# EAGLE design warm_floor (EAGLE 7.4.0)
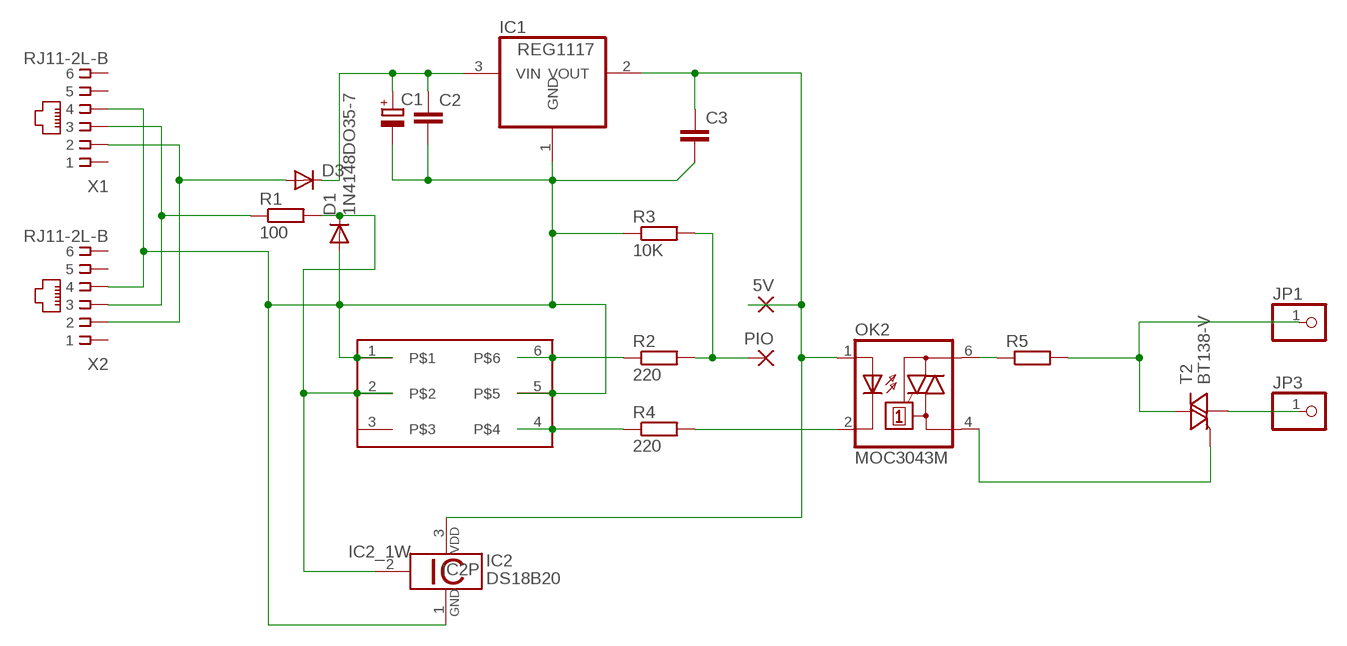
[diagram p0: schematic, sheet 1]

## Parts
5V  1,6/0,8  [1,6/0,8]
C1  CPOL-EUE5-10.5  [E5-10,5]
C2  C-EUC1206  [C1206]
C3  C-EUC1206  [C1206]
D1  1N4148DO35-7  [DO35-7]
D3  DIODE-MINIMELF  [MINIMELF]
DS2413  DS2413P  [TSOC6]
IC1  REG1117  [SOT223]
IC2  DS18B20  [TO92-]
JP1  PINHD-1X1  [1X01]
JP3  PINHD-1X1  [1X01]
OK2  MOC3043M  [DIL06]
PIO  1,6/0,8  [1,6/0,8]
R1  100  R-EU_M1206  [M1206]
R2  220  R-EU_M1206  [M1206]
R3  10K  R-EU_M1206  [M1206]
R4  220  R-EU_M1206  [M1206]
R5  R-EU_M1206  [M1206]
T2  BT138-V  [TO220BV]
X1  RJ11-2L-B  [RJ11-NO_SHIELD]
X2  RJ11-2L-B  [RJ11-NO_SHIELD]

## Nets
N$1: PIO.1(P) R2.2 R3.2
N$2: R1.1 X1.3 X2.3
N$3: D3.A X1.2 X2.2
N$4: D1.C DS2413.2 IC2.2 R1.2
N$5: C1.+ C2.1 D3.C IC1.3(VIN)
N$6: 5V.1(P) C3.1 IC1.2(VOUT) IC2.3 OK2.1(A)
N$8: OK2.4(A1) T2.G
N$9: DS2413.6 R2.1
N$10: DS2413.4 R4.1
N$11: C1.- C2.2 C3.2 D1.A DS2413.1 DS2413.5 IC1.1(GND) IC2.1 R3.1 X1.4 X2.4
N$12: OK2.2(C) R4.2
N$14: JP1.1 R5.2 T2.T2(A2)
N$17: JP3.1 T2.T1(A1)
N$21: OK2.6(A2) R5.1
Unconnected: DS2413.3 X1.1 X1.5 X1.6 X2.1 X2.5 X2.6

## Library data of the parts
5V PIO = wirepad:1,6/0,8: THROUGH-HOLE PAD
C1 = rcl:CPOL-EU: POLARIZED CAPACITOR, European symbol
C2 C3 = rcl:C-EU: CAPACITOR, European symbol
D1 = diode:1N4148: DIODE high speed (Philips)
D3 = diode:DIODE-: DIODE
DS2413 = barsmonster:DS2413P
IC1 = burr-brown:REG1117: 800mA and 1A Low Dropout (LDO) Positive Regulator 1.8V, 2.5V, 2.85V, 3.3V, 5V, and Adj
IC2 = 1wire:DS18B20: Programmable Resolution Digital Thermometer This chip provides a onewire thermosensor with approx. 0.5°C accuracy. A programmable over/undertemperure alarm is available. The precision can be set from 9..12 bits. Notes: Vdd must be applied for accurate measurements at low temperatures, as the parasite power circuit otherwise heats the sensor. If parasite power is used, Vdd has to be connected to GND. The DS1822 is a low-cost thermometer chip, the DS18S20 is similar to the DS18B20, but with 9 Bit precision only. Author: Jan Kandziora <jjj@gmx.de>
JP1 JP3 = pinhead:PINHD-1X1: PIN HEADER
OK2 = optocoupler:MOC30*: 6-Pin DIP Zero-Cross Optoisolators Triac Driver Output (250/400 Volt Peak) Source: http://www.fairchildsemi.com/ds/MO/MOC3043-M.pdf
R1-R5 = rcl:R-EU_: RESISTOR, European symbol
T2 = triac:BT138: TRIAC Source: http://www.semiconductors.philips.com BT138_SERIES_2.pdf
X1 X2 = con-tycoelectronics:RJ11: CORCOM Modular RJ Jacks No Shield Source: www.tycoelectronics.com .. ENG_DS_1654001_1099_RJ_L_0507.pdf; MF: TYCO ELECTRONICS; MPN: RJ11-2L-B; OC_FARNELL: unknown; OC_NEWARK: 83F4463

## Board
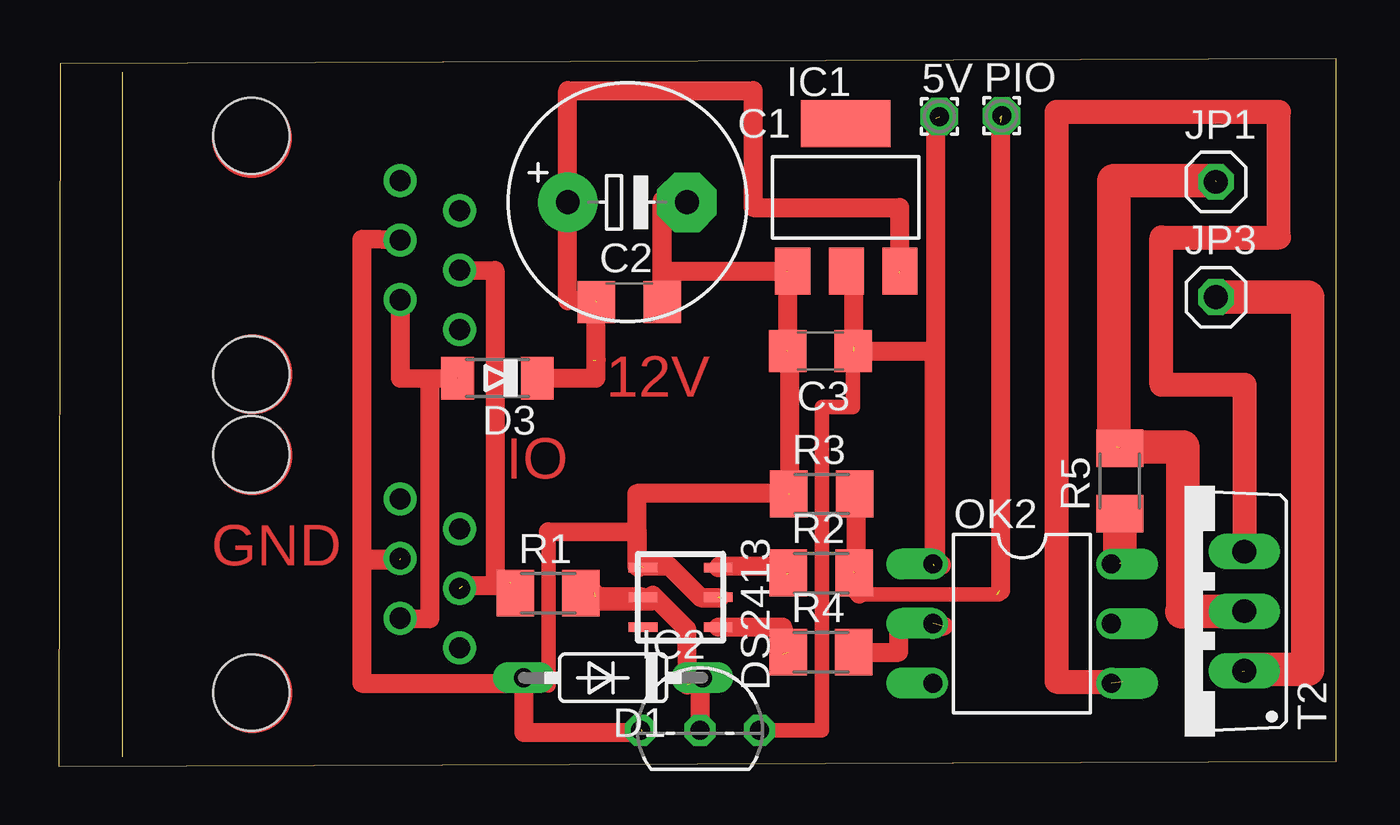
[diagram p1: board, top side]
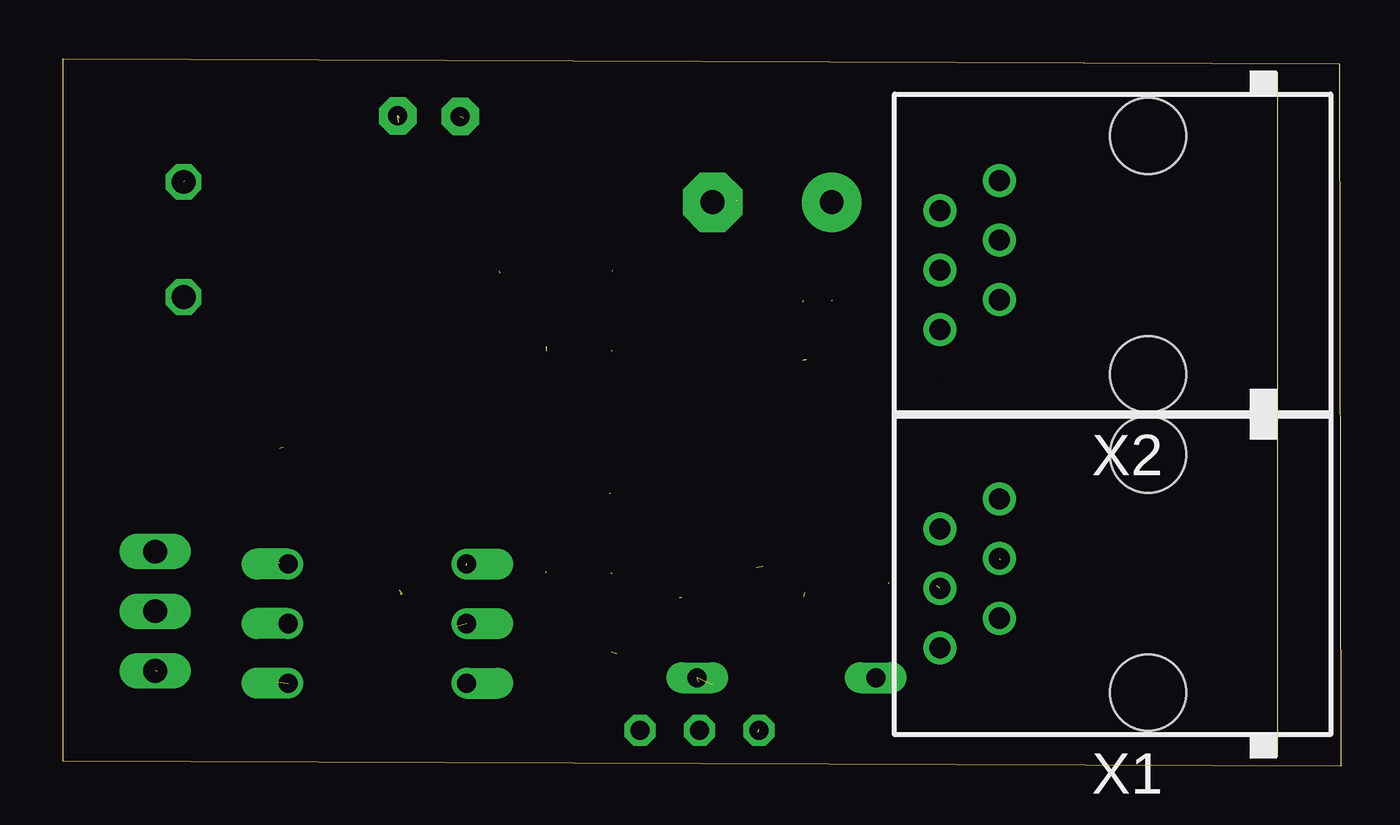
[diagram p2: board, bottom side, seen from below]

Size 54.5 x 30.18 mm. Coordinates in mm from the lower left corner, seen from the top.
Outline: 0,0 54.5,0.21 54.5,30.18 0.07,29.97 0,0
Copper layers (1*16): Top 0.035mm / dielectric 1.5mm / Bottom 0.035mm
Design rules "default": minimum track width 10mil, minimum drill 24mil, track to track 8mil, track to pad 8mil, pad to pad 8mil, via to via 8mil, smd to smd 8mil, copper to edge 40mil, drill to drill 8mil, minimum pad ring 10mil, minimum via ring 8mil, stop-mask expansion 4mil, vias tented up to drill 0mil, thermal gap 10mil

### Footprints (pad centres in the part's own frame; a part is rotated, then mirrored left to right if it is on the bottom)
1,6/0,8 = drill 0.813 pad 1.6 octagon: 1 0,0
E5-10,5 = drill 1.016 pad 2.54: + -2.54,0 | drill 1.016 pad 2.54 octagon: - 2.54,0
C1206 = smd 1.6 x 1.8: 1 -1.4,0; 2 1.4,0
DO35-7 = drill 0.813 long: A 3.81,0; C -3.81,0
MINIMELF = smd 1.4 x 1.8: A 1.7,0; C -1.7,0
TSOC6 = smd 0.406 x 1.219: 1 -1.27,-1.6; 2 0,-1.6; 3 1.27,-1.6; 4 1.27,1.6; 5 0,1.6; 6 -1.27,1.6
SOT223 = smd 1.499 x 2.007: 1 -2.261,-3.15; 2 0.025,-3.15; 3 2.311,-3.15 | smd 3.81 x 2.007: 4 0,3.15
TO92- = drill 0.813 octagon: 1 -2.54,0; 2 0,0; 3 2.54,0
1X01 = drill 1.016 octagon: 1 0,0
DIL06 = drill 0.813 offset: 1 -2.54,-3.81; 2 0,-3.81; 3 2.54,-3.81; 4 2.54,3.81; 5 0,3.81; 6 -2.54,3.81
M1206 = smd 1.6 x 2: 1 -1.4,0; 2 1.4,0
TO220BV = drill 1.016 long: G 2.54,-2.54; T1 -2.54,-2.54; T2 0,-2.54
RJ11-NO_SHIELD = drill 0.9 pad 1.4: 1 -3.175,8.89; 2 -1.905,6.35; 3 -0.635,8.89; 4 0.635,6.35; 5 1.905,8.89; 6 3.175,6.35 | hole 3.251: -5.08,0; 5.08,0

### Placement (x,y rotation side)
5V  37.57,27.71 0 top
C1  24.26,24.06 0 top
C2  24.34,19.79 0 top
C3  32.5,17.71 180 top
D1  23.65,3.77 180 top
D3  18.72,16.55 180 top
DS2413  26.53,7.2 270 top
IC1  33.57,24.26 0 top
IC2  27.36,1.52 0 top
JP1  49.36,24.93 0 top
JP3  49.36,20.01 0 top
OK2  41.1,6.08 270 top
PIO  40.23,27.75 0 top
R1  20.88,7.38 0 top
R2  32.53,8.24 0 top
R3  32.55,11.61 0 top
R4  32.51,4.86 0 top
R5  45.26,12.16 90 top
T2  48.04,6.61 90 top
X1  8.22,8.21 90 bottom
X2  8.22,21.8 90 bottom

### Tracks (layer width: path | path; a pad name or v marks a point on that pad's centre or on a via)
N$1  (5 unrouted)
  Top 0.61: 34.14,7.33 40.1,7.33 | 34.01,7.49 33.91,7.49 33.91,8.3
  Top 0.813: R3.2 33.94,11.65 34.01,11.58 34.01,7.49 34.14,7.33 | 40.16,7.49 40.18,7.49 40.18,27.47
N$2  (2 unrouted)
  Top 0.254: 19.28,7.83 R1.1
  Top 0.61: 18.61,7.69 19.27,7.69 19.27,7.79
  Top 0.813: X2.3 18.61,21.15 18.61,7.69 17.22,7.69 17.22,7.83
N$3  (1 unrouted)
  Top 0.813: X1.2 15.84,6.28 15.84,16.53 | 15.84,16.53 D3.A | X2.2 14.57,16.55 15.84,16.53
N$4  (3 unrouted)
  Top 0.813: R1.2 22.86,7.39 22.86,7.05 25.36,7.05 25.34,7.3 26.79,5.84 26.81,3.46 | DS2413.2 24.91,7.22 22.89,7.22 | IC2.2 27.39,1.91 27.39,3.59
N$5  (5 unrouted)
  Top 0.254: 22.78,19.33 C2.1
  Top 0.61: C1.+ 21.69,24.06 21.69,19.83
  Top 0.813: 22.93,17.33 22.93,19.85 21.71,19.85 21.71,28.82 29.62,28.82 29.62,23.83 35.87,23.83 35.87,21.03 | D3.C 22.92,16.55 22.92,17.29
N$6  (4 unrouted)
  Top 0.61: IC2.3 32.55,1.52 32.55,15.32 33.87,15.32 33.87,17.74
  Top 0.813: IC1.2 33.89,20.81 33.89,17.9 | C3.1 37.34,17.71 37.34,8.56 37.66,8.56 37.66,8.6 37.42,8.6 37.42,27.63
N$8  (1 unrouted)
  Top 1.016: T2.G 50.59,9.15 50.59,16.26 47.04,16.26 47.04,22.55 52.05,22.55 52.05,27.91 42.57,27.91 42.57,3.59 45.39,3.59
N$9  (1 unrouted)
  Top 0.813: DS2413.6 28.19,8.54 31.2,8.54 31.2,8.33 31.07,8.2 | 31.07,8.2
N$10  (1 unrouted)
  Top 0.813: DS2413.4 30.89,5.93 30.89,4.79
N$11  (10 unrouted)
  Top 0.813: X2.4 12.93,22.47 12.93,8.79 14.55,8.79 14.55,8.82 12.93,8.82 12.93,3.54 19.83,3.54 | IC1.1 31.1,21.11 31.1,17.73 31.17,17.73 31.17,11.62 24.65,11.62 24.65,8.53 26.04,8.53 27.39,7.18 | 27.39,7.18 28.2,7.18 | D1.A 19.84,1.43 24.88,1.43 | C2.2 25.74,24.06 26.47,24.06 | 26.86,24.06 26.47,24.06 | 26.47,24.06 26.47,24.14 25.74,24.14 25.74,20.31 25.78,20.31 25.78,21.12 31.06,21.12 | C1.- 26.82,24.07 26.82,24.11 25.75,24.11 | IC2.1 24.82,1.56 24.83,1.56 | 27.39,7.18 27.39,7.19 28.2,7.19
N$12  (1 unrouted)
  Top 0.813: R4.2 35.84,4.86 35.84,5.97 37.74,5.97
N$14  (2 unrouted)
  Top 1.422: T2.T2 47.91,6.61 47.91,6.57 47.95,6.57 47.95,13.61 45.11,13.61 45.11,13.64 45.01,13.64 45.01,24.97 49.33,24.97 49.33,24.87
N$16
  Top 0.61: 20.88,9.99 20.89,9.99 20.89,3.45
  Top 0.813: 20.88,9.99 24.67,10.02 24.67,8.51 24.76,8.51 24.76,8.47
N$17  (1 unrouted)
  Top 1.422: JP3.1 53.27,20.01 53.27,4.13 50.5,4.13 50.5,4.03
N$21  (1 unrouted)
  Top 0.254: 45.28,10.33 R5.1 | 45.28,8.83 OK2.6
  Top 1.422: 45.28,10.33 45.26,10.33 45.26,8.67
(copper drawn outside any net)
  shapes: Top circle x4

### Text on the board
Top: 12V | IO | GND